# EAGLE schematic Gondola_Sail_electronics_M4 (EAGLE 9.3.0)
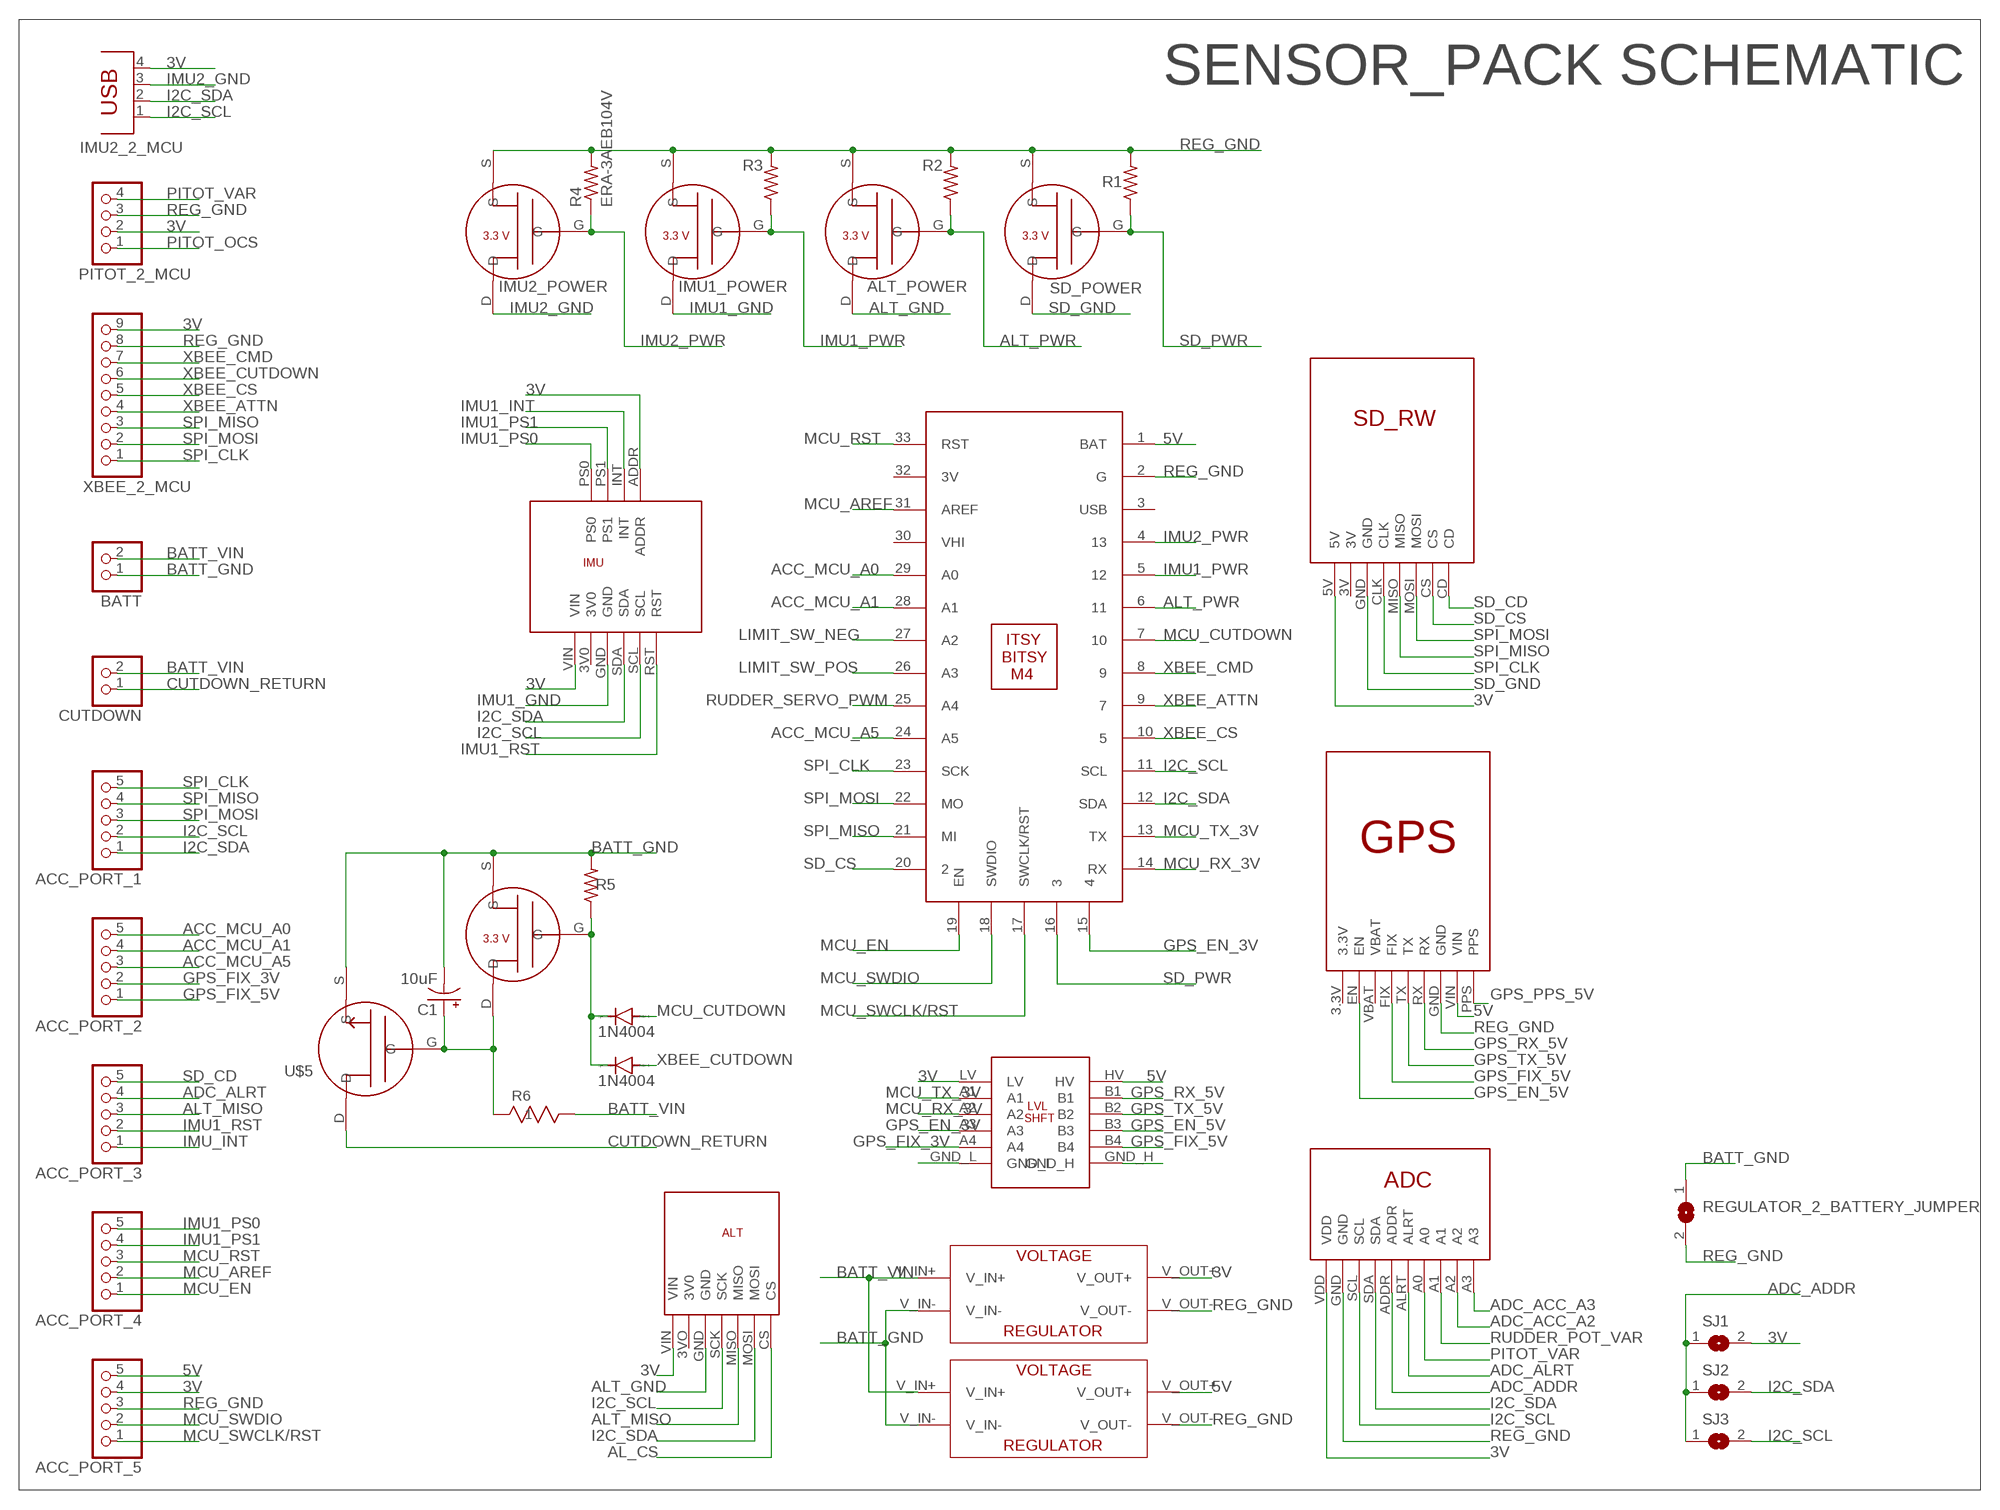
[diagram p0: schematic, sheet 1]

## Parts
3V_REG  3V/5V_REGULATOR  [5V/3V_REGULATOR]
5V_REG  3V/5V_REGULATOR  [5V/3V_REGULATOR]
ACC_PORT_1  PINHD-1X5/90  [1X05/90]
ACC_PORT_2  PINHD-1X5/90  [1X05/90]
ACC_PORT_3  PINHD-1X5/90  [1X05/90]
ACC_PORT_4  PINHD-1X5/90  [1X05/90]
ACC_PORT_5  PINHD-1X5/90  [1X05/90]
ALT_POWER  3.3V_NCH_FET  [3.3VTRANSISTOR]
BATT  PINHD-1X2/90  [1X02/90]
C1  10uF  10UF-POLAR-RADIAL-2.5MM-25V-20%  [CPOL-RADIAL-2.5MM-5MM]
CUTDOWN  PINHD-1X2/90  [1X02/90]
D1  1N4004  [DO41-10]
D2  1N4004  [DO41-10]
IMU1  BNO055  [BNO055]
IMU1_POWER  3.3V_NCH_FET  [3.3VTRANSISTOR]
IMU2_2_MCU  PN87520  [PN87520]
IMU2_POWER  3.3V_NCH_FET  [3.3VTRANSISTOR]
PITOT_2_MCU  PINHD-1X4/90  [1X04/90]
R1  ERA-3AEB104V  [RESC1608X55]
R2  ERA-3AEB104V  [RESC1608X55]
R3  ERA-3AEB104V  [RESC1608X55]
R4  ERA-3AEB104V  [RESC1608X55]
R5  ERA-3AEB104V  [RESC1608X55]
R6  RR0816P-103-D  [RES_0816]
REGULATOR_2_BATTERY_JUMPER  SJW  [SJW]
SD_POWER  3.3V_NCH_FET  [3.3VTRANSISTOR]
SD_POWER1  3.3V_NCH_FET  [3.3VTRANSISTOR]
SJ1  SJ  [SJ]
SJ2  SJ  [SJ]
SJ3  SJ  [SJ]
U$1  ADAFRUIT_GPS  [ADAFRUIT_GPS]
U$2  ADAFRUI_SD_RW  [ADAFRUIT_SD_RW]
U$3  ADS1115  [ADS1115]
U$4  BME280  [BME280]
U$5  CUTDOWN_POWER_TRANSISTOR  [T03B]
U$6  BSS138_LVLSHIFT  [BSS138_LEVELSHIFT]
U$8  ITSY_BITSY_M4  [ITSY_BITSY_M4]
XBEE_2_MCU  PINHD-1X9/90  [1X09/90]

## Nets
3V: 3V_REG.V_OUT+ ACC_PORT_5.4 IMU1.ADDR IMU1.VIN IMU2_2_MCU.4 PITOT_2_MCU.2 SJ1.2 U$2.5V U$3.VDD U$4.VIN U$6.LV XBEE_2_MCU.9
5V: 5V_REG.V_OUT+ ACC_PORT_5.5 U$1.VIN U$6.HV U$8.1(BAT)
ACC_MCU_A0: ACC_PORT_2.5 U$8.29(A0)
ACC_MCU_A1: ACC_PORT_2.4 U$8.28(A1)
ACC_MCU_A5: ACC_PORT_2.3 U$8.24(A5)
ADC_ACC_A2: U$3.A2
ADC_ACC_A3: U$3.A3
ADC_ADDR: SJ1.1 SJ2.1 SJ3.1 U$3.ADDR
ADC_ALRT: ACC_PORT_3.4 U$3.ALRT
AL_CS: U$4.CS
ALT_GND: ALT_POWER.D U$4.GND
ALT_MISO: ACC_PORT_3.3 U$4.MISO
ALT_PWR: ALT_POWER.G R2.1 U$8.6
BATT_GND: 3V_REG.V_IN- 5V_REG.V_IN- BATT.1 C1.2(-) R5.2 REGULATOR_2_BATTERY_JUMPER.1 SD_POWER1.S U$5.S
BATT_VIN: 3V_REG.V_IN+ 5V_REG.V_IN+ BATT.2 CUTDOWN.2 R6.2
CUTDOWN: D1.C D2.C R5.1 SD_POWER1.G
CUTDOWN_RETURN: CUTDOWN.1 U$5.D
GPS_EN_3V: U$6.A3 U$8.15
GPS_EN_5V: U$1.EN U$6.B3
GPS_FIX_3V: ACC_PORT_2.2 U$6.A4
GPS_FIX_5V: ACC_PORT_2.1 U$1.FIX U$6.B4
GPS_PPS_5V: U$1.PPS
GPS_RX_5V: U$1.RX U$6.B1
GPS_TX_5V: U$1.TX U$6.B2
I2C_SCL: ACC_PORT_1.2 IMU1.SCL IMU2_2_MCU.1 SJ3.2 U$3.SCL U$4.SCK U$8.11(SCL)
I2C_SDA: ACC_PORT_1.1 IMU1.SDA IMU2_2_MCU.2 SJ2.2 U$3.SDA U$4.MOSI U$8.12(SDA)
IMU1_GND: IMU1.GND IMU1_POWER.D
IMU1_INT: IMU1.INT
IMU1_PS0: ACC_PORT_4.5 IMU1.PS0
IMU1_PS1: ACC_PORT_4.4 IMU1.PS1
IMU1_PWR: IMU1_POWER.G R3.1 U$8.5
IMU1_RST: ACC_PORT_3.2 IMU1.RST
IMU2_GND: IMU2_2_MCU.3 IMU2_POWER.D
IMU2_PWR: IMU2_POWER.G R4.1 U$8.4
IMU_INT: ACC_PORT_3.1
LIMIT_SW_NEG: U$8.27(A2)
LIMIT_SW_POS: U$8.26(A3)
MCU_AREF: ACC_PORT_4.2 U$8.31(AREF)
MCU_CUTDOWN: D1.A U$8.7
MCU_EN: ACC_PORT_4.1 U$8.19(EN)
MCU_RST: ACC_PORT_4.3 U$8.33(RST)
MCU_RX_3V: U$6.A2 U$8.14(RX)
MCU_SWCLK/RST: ACC_PORT_5.1 U$8.17(SWCLK/RST)
MCU_SWDIO: ACC_PORT_5.2 U$8.18(SWDIO)
MCU_TX_3V: U$6.A1 U$8.13(TX)
N$1: U$6.GND_L
N$2: U$6.GND_H
N$5: C1.1(+) R6.1 SD_POWER1.D U$5.G
PITOT_OCS: PITOT_2_MCU.1
PITOT_VAR: PITOT_2_MCU.4 U$3.A0
REG_GND: 3V_REG.V_OUT- 5V_REG.V_OUT- ACC_PORT_5.3 ALT_POWER.S IMU1_POWER.S IMU2_POWER.S PITOT_2_MCU.3 R1.2 R2.2 R3.2 R4.2 REGULATOR_2_BATTERY_JUMPER.2 SD_POWER.S U$1.GND U$3.GND U$8.2(G) XBEE_2_MCU.8
RUDDER_POT_VAR: U$3.A1
RUDDER_SERVO_PWM: U$8.25(A4)
SD_CD: ACC_PORT_3.5 U$2.CD
SD_CS: U$2.CS U$8.20
SD_GND: SD_POWER.D U$2.GND
SD_PWR: R1.1 SD_POWER.G U$8.16
SPI_CLK: ACC_PORT_1.5 U$2.CLK U$8.23(SCK) XBEE_2_MCU.1
SPI_MISO: ACC_PORT_1.4 U$2.MISO U$8.21(MI) XBEE_2_MCU.3
SPI_MOSI: ACC_PORT_1.3 U$2.MOSI U$8.22(MO) XBEE_2_MCU.2
XBEE_ATTN: U$8.9 XBEE_2_MCU.4
XBEE_CMD: U$8.8 XBEE_2_MCU.7
XBEE_CS: U$8.10 XBEE_2_MCU.5
XBEE_CUTDOWN: D2.A XBEE_2_MCU.6
Unconnected: IMU1.3V0 U$1.3.3V U$1.VBAT U$2.3V U$4.3VO(3V0) U$8.3(USB) U$8.30(VHI) U$8.32(3V)

## Notes on the sheet
- SENSOR_PACK SCHEMATIC

## Library data of the parts
3V_REG 5V_REG = Adafruit_Arduino:3V/5V_REGULATOR
ACC_PORT_1-ACC_PORT_5 = pinhead:PINHD-1X5: PIN HEADER
ALT_POWER IMU1_POWER IMU2_POWER SD_POWER SD_POWER1 = Adafruit_Arduino:3.3V_NCH_FET
BATT CUTDOWN = pinhead:PINHD-1X2: PIN HEADER
C1 = SparkFun-Capacitors:10UF-POLAR: 10.0µF polarized capacitors A capacitor is a passive two-terminal electrical component used to store electrical energy temporarily in an electric field.; PROD_ID: CAP-08440
D1 D2 = diode:1N4004: DIODE general purpose rectifier, 1 A
IMU1 = Adafruit_Arduino:BNO055
IMU2_2_MCU = con-berg:PN87520: BERG USB connector; OC_FARNELL: unknown; OC_NEWARK: unknown
PITOT_2_MCU = pinhead:PINHD-1X4: PIN HEADER
R1-R5 = ERA-3AEB104V:ERA-3AEB104V: METAL FILM RESISTOR, 100KOHM, 100mW, 0.1%; DESCRIPTION: Res Thin Film 0603 100K Ohm 0.1% 0.1W_1/10W_ Ø¢±25ppm/Ø¢°C Molded SMD Automotive Punched T/R; DIGI-KEY_PART_NUMBER: P100KDBCT-ND; DIGI-KEY_PURCHASE_URL: https://www.digikey.com/product-detail/en/panasonic-electronic-components/ERA-3AEB104V/P100KDBCT-ND/1466100?utm_source=snapeda&utm_medium=aggregator&utm_campaign=symbol; MF: Panasonic; MP: ERA-3AEB104V; PACKAGE: 0603 Panasonic
R6 = 10K_SMD_resistors_RR0816p-103-D:RR0816P-103-D; MANUFACTURER_PART_NUMBER: RR0816P103D; VENDOR: Susumu
REGULATOR_2_BATTERY_JUMPER SJ1-SJ3 = jumper:SJ: SMD solder JUMPER
U$1 = Adafruit_Arduino:ADAFRUIT_GPS
U$2 = Adafruit_Arduino:ADAFRUI_SD_RW
U$3 = Adafruit_Arduino:ADS1115
U$4 = Adafruit_Arduino:BME280
U$5 = Ultrasonic Misc PieceParts:CUTDOWN_POWER_TRANSISTOR
U$6 = Adafruit_Arduino:BSS138_LVLSHIFT
U$8 = Adafruit_Arduino:ITSY_BITSY_M4
XBEE_2_MCU = pinhead:PINHD-1X9: PIN HEADER